# EAGLE schematic EvaluationBoard (EAGLE 9.3.1)

## Sheet 1 of 5
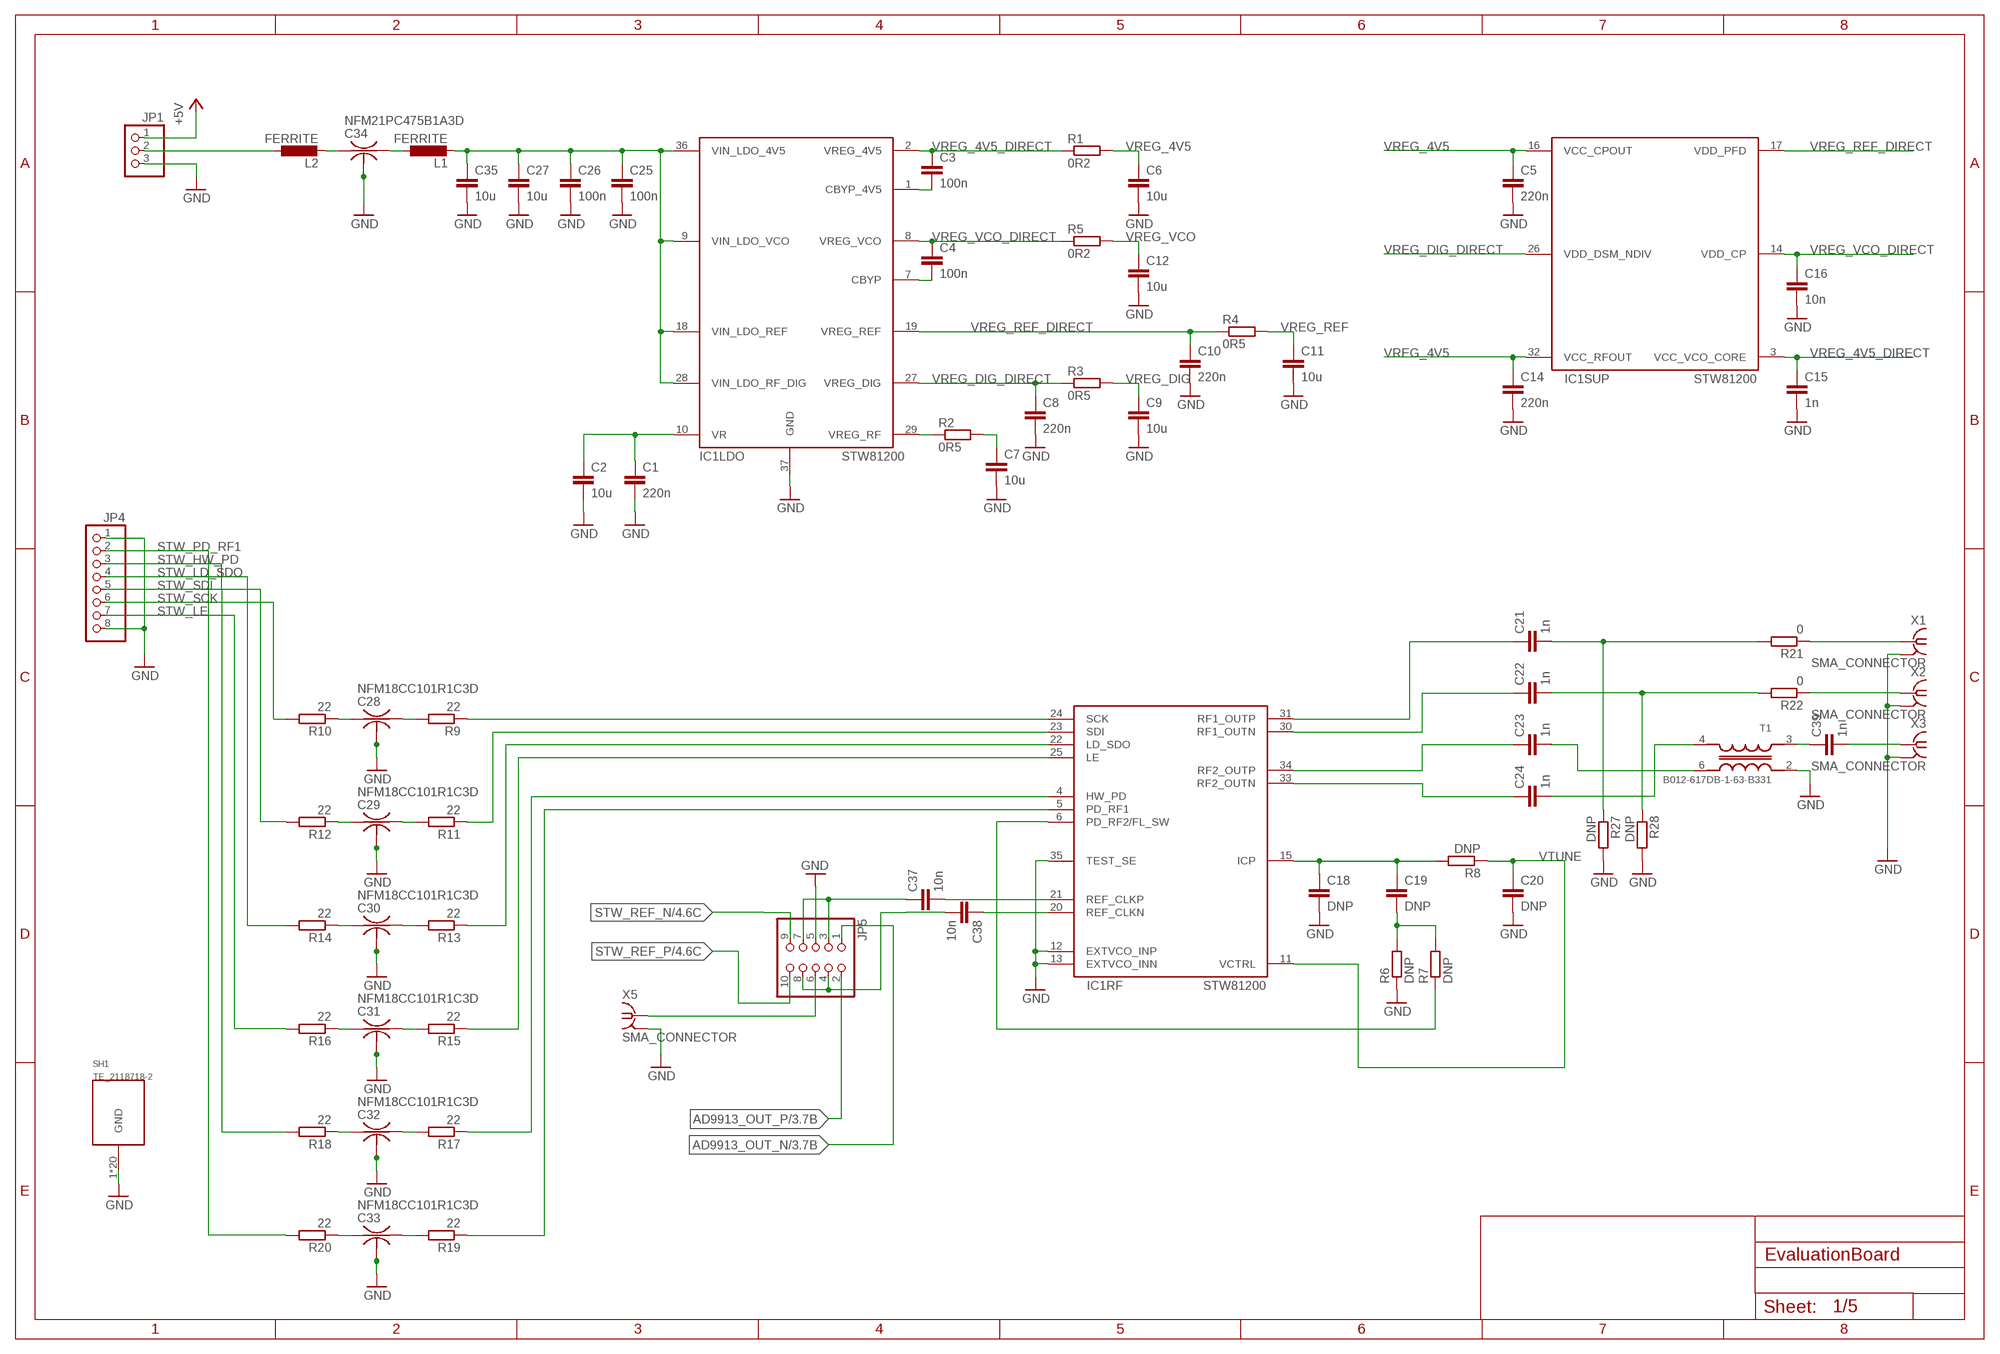
[diagram p0: schematic, sheet 1]

### Parts
C1  220n  C-EUC0402  [C0402]
C2  10u  C-EUC0603  [C0603]
C3  100n  C-EUC0402  [C0402]
C4  100n  C-EUC0402  [C0402]
C5  220n  C-EUC0402  [C0402]
C6  10u  C-EUC0603  [C0603]
C7  10u  C-EUC0603  [C0603]
C8  220n  C-EUC0402  [C0402]
C9  10u  C-EUC0603  [C0603]
C10  220n  C-EUC0402  [C0402]
C11  10u  C-EUC0603  [C0603]
C12  10u  C-EUC0603  [C0603]
C14  220n  C-EUC0402  [C0402]
C15  1n  C-EUC0402  [C0402]
C16  10n  C-EUC0402  [C0402]
C18  DNP  C-EUC0402  [C0402]
C19  DNP  C-EUC0402  [C0402]
C20  DNP  C-EUC0402  [C0402]
C21  1n  C-EUC0402  [C0402]
C22  1n  C-EUC0402  [C0402]
C23  1n  C-EUC0402  [C0402]
C24  1n  C-EUC0402  [C0402]
C25  100n  C-EUC0402  [C0402]
C26  100n  C-EUC0402  [C0402]
C27  10u  C-EUC0603  [C0603]
C28  NFM18CC101R1C3D  [NFM18PC]
C29  NFM18CC101R1C3D  [NFM18PC]
C30  NFM18CC101R1C3D  [NFM18PC]
C31  NFM18CC101R1C3D  [NFM18PC]
C32  NFM18CC101R1C3D  [NFM18PC]
C33  NFM18CC101R1C3D  [NFM18PC]
C34  NFM21PC475B1A3D  [NFM21PC]
C35  10u  C-EUC0603  [C0603]
C37  10n  C-EUC0402  [C0402]
C38  10n  C-EUC0402  [C0402]
C39  1n  C-EUC0402  [C0402]
IC1  STW81200  [QFN50P600X600X100-37T410N]
JP1  PINHD-1X3  [1X03]
JP4  PINHD-1X8  [1X08]
JP5  PINHD-2X5  [2X05]
L1  FERRITE  [R0402]
L2  FERRITE  [R0402]
R1  0R2  R-EU_R0402  [R0402]
R2  0R5  R-EU_R0402  [R0402]
R3  0R5  R-EU_R0402  [R0402]
R4  0R5  R-EU_R0402  [R0402]
R5  0R2  R-EU_R0402  [R0402]
R6  DNP  R-EU_R0402  [R0402]
R7  DNP  R-EU_R0402  [R0402]
R8  DNP  R-EU_R0402  [R0402]
R9  22  R-EU_R0402  [R0402]
R10  22  R-EU_R0402  [R0402]
R11  22  R-EU_R0402  [R0402]
R12  22  R-EU_R0402  [R0402]
R13  22  R-EU_R0402  [R0402]
R14  22  R-EU_R0402  [R0402]
R15  22  R-EU_R0402  [R0402]
R16  22  R-EU_R0402  [R0402]
R17  22  R-EU_R0402  [R0402]
R18  22  R-EU_R0402  [R0402]
R19  22  R-EU_R0402  [R0402]
R20  22  R-EU_R0402  [R0402]
R21  0  R-EU_R0402  [R0402]
R22  0  R-EU_R0402  [R0402]
R27  DNP  R-EU_R0402  [R0402]
R28  DNP  R-EU_R0402  [R0402]
SH1  TE_2118718-2  [TE_2118718-2]
T1  B012-617DB-1-63-B331  [EASTEVER_BALUN]
X1  SMA_CONNECTOR  [J502-ND-142-0711-821/826]
X2  SMA_CONNECTOR  [J502-ND-142-0711-821/826]
X3  SMA_CONNECTOR  [J502-ND-142-0711-821/826]
X5  SMA_CONNECTOR  [J502-ND-142-0711-821/826]

### Nets
+5V: JP1.1 ; also sheet 5
AD9913_OUT_N [100 Ohm differential]: JP5.1 ; also sheet 3
AD9913_OUT_P [100 Ohm differential]: JP5.2 ; also sheet 3
GND: C1.2 C2.2 C5.2 C6.2 C7.2 C8.2 C9.2 C10.2 C11.2 C12.2 C14.2 C15.2 C16.2 C18.2 C20.2 C25.2 C26.2 C27.2 C28.2 C28.4 C29.2 C29.4 C30.2 C30.4 C31.2 C31.4 C32.2 C32.4 C33.2 C33.4 C34.2 C34.4 C35.2 IC1.12(RF:EXTVCO_INP) IC1.13(RF:EXTVCO_INN) IC1.35(RF:TEST_SE) IC1.37(LDO:GND) JP1.3 JP4.1 JP4.8 JP5.5 R6.1 R27.2 R28.2 SH1.1(GND) SH1.2(GND) SH1.3(GND) SH1.4(GND) SH1.5(GND) SH1.6(GND) SH1.7(GND) SH1.8(GND) SH1.9(GND) SH1.10(GND) SH1.11(GND) SH1.12(GND) SH1.13(GND) SH1.14(GND) SH1.15(GND) SH1.16(GND) SH1.17(GND) SH1.18(GND) SH1.19(GND) SH1.20(GND) T1.2(IN-) X1.G@1 X1.G@2 X1.G@3 X1.G@4 X2.G@1 X2.G@2 X2.G@3 X2.G@4 X3.G@1 X3.G@2 X3.G@3 X3.G@4 X5.G@1 X5.G@2 X5.G@3 X5.G@4 ; also sheet 2,3,4,5
N$1: C1.1 C2.1 IC1.10(LDO:VR)
N$2: IC1.6(RF:PD_RF2/FL_SW) R7.1
N$3: C4.2 IC1.7(LDO:CBYP)
N$4: C3.2 IC1.1(LDO:CBYP_4V5)
N$5: C19.2 R6.2 R7.2
N$6: C18.1 C19.1 IC1.15(RF:ICP) R8.2
N$7: C25.1 C26.1 C27.1 C35.1 IC1.9(LDO:VIN_LDO_VCO) IC1.18(LDO:VIN_LDO_REF) IC1.28(LDO:VIN_LDO_RF_DIG) IC1.36(LDO:VIN_LDO_4V5) L1.2
N$8: IC1.29(LDO:VREG_RF) R2.1
N$9: C7.1 R2.2
N$10: C23.1 IC1.34(RF:RF2_OUTP)
N$11: C24.1 IC1.33(RF:RF2_OUTN)
N$12: C22.1 IC1.30(RF:RF1_OUTN)
N$13: C21.1 IC1.31(RF:RF1_OUTP)
N$14: C28.1 R10.1
N$15: C28.3 R9.2
N$16: C29.1 R12.1
N$17: C29.3 R11.2
N$18: C30.1 R14.1
N$19: C30.3 R13.2
N$20: C31.1 R16.1
N$21: C31.3 R15.2
N$22: C32.1 R18.1
N$23: C32.3 R17.2
N$24: C33.1 R20.1
N$25: C33.3 R19.2
N$26: IC1.24(RF:SCK) R9.1
N$27: IC1.23(RF:SDI) R11.1
N$28: IC1.22(RF:LD_SDO) R13.1
N$29: IC1.25(RF:LE) R15.1
N$30: IC1.4(RF:HW_PD) R17.1
N$31: IC1.5(RF:PD_RF1) R19.1
N$32: C34.3 L1.1
N$33: C34.1 L2.2
N$34: R22.1 X2.1
N$35: C22.2 R22.2 R28.1
N$36: C23.2 T1.6(OUT-)
N$37: C39.1 T1.3(IN+)
N$38: C21.2 R21.2 R27.1
N$39: R21.1 X1.1
N$40: C39.2 X3.1
N$42: JP5.6 X5.1
N$47: JP1.2 L2.1
N$54: C24.2 T1.4(OUT+)
STW81200_C_N [100 Ohm differential]: C38.2 JP5.4 JP5.8
STW81200_C_P [100 Ohm differential]: C37.1 JP5.3 JP5.7
STW81200_CLK_N [100 Ohm differential]: C38.1 IC1.20(RF:REF_CLKN)
STW81200_CLK_P [100 Ohm differential]: C37.2 IC1.21(RF:REF_CLKP)
STW_HW_PD: JP4.3 R18.2 ; also sheet 5
STW_LD_SDO: JP4.4 R14.2 ; also sheet 5
STW_LE: JP4.7 R16.2 ; also sheet 5
STW_PD_RF1: JP4.2 R20.2 ; also sheet 5
STW_REF_N [100 Ohm differential]: JP5.9 ; also sheet 4
STW_REF_P [100 Ohm differential]: JP5.10 ; also sheet 4
STW_SCK: JP4.6 R10.2 ; also sheet 5
STW_SDI: JP4.5 R12.2 ; also sheet 5
VREG_4V5: C5.1 C6.1 C14.1 IC1.16(SUP:VCC_CPOUT) IC1.32(SUP:VCC_RFOUT) R1.2
VREG_4V5_DIRECT: C3.1 C15.1 IC1.2(LDO:VREG_4V5) IC1.3(SUP:VCC_VCO_CORE) R1.1
VREG_DIG: C9.1 R3.2
VREG_DIG_DIRECT: C8.1 IC1.26(SUP:VDD_DSM_NDIV) IC1.27(LDO:VREG_DIG) R3.1
VREG_REF: C11.1 R4.2
VREG_REF_DIRECT: C10.1 IC1.17(SUP:VDD_PFD) IC1.19(LDO:VREG_REF) R4.1
VREG_VCO: C12.1 R5.2
VREG_VCO_DIRECT: C4.1 C16.1 IC1.8(LDO:VREG_VCO) IC1.14(SUP:VDD_CP) R5.1
VTUNE: C20.1 IC1.11(RF:VCTRL) R8.1

## Sheet 2 of 5
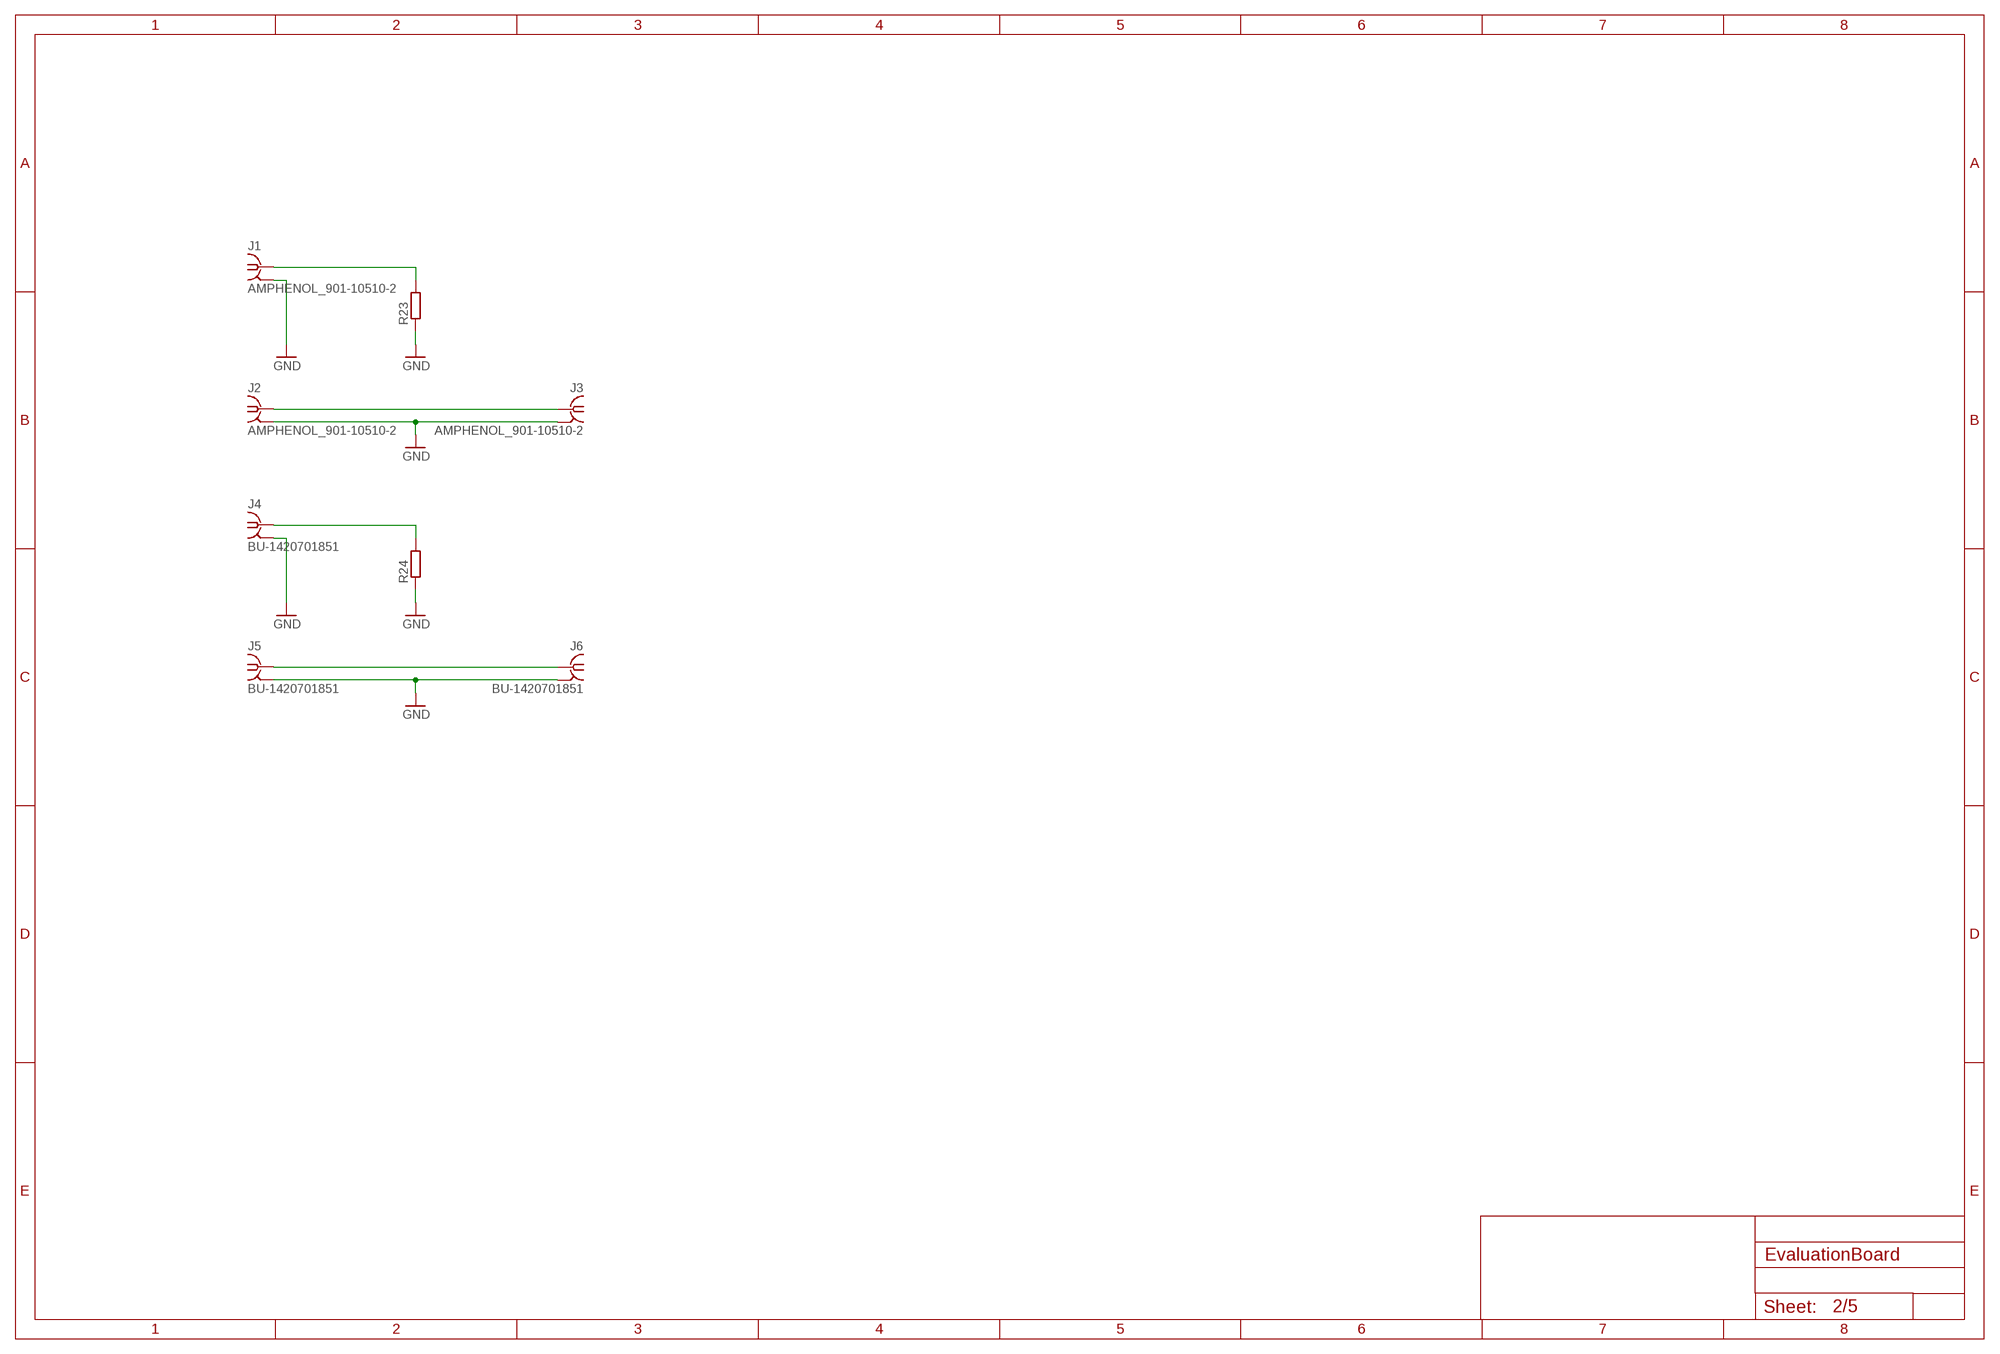
[diagram p1: schematic, sheet 2]

### Parts
J1  AMPHENOL_901-10510-2  [AMPHENOL_901-10510-2]
J2  AMPHENOL_901-10510-2  [AMPHENOL_901-10510-2]
J3  AMPHENOL_901-10510-2  [AMPHENOL_901-10510-2]
J4  BU-1420701851  [BU-1420701851]
J5  BU-1420701851  [BU-1420701851]
J6  BU-1420701851  [BU-1420701851]
R23  R-EU_R0402  [R0402]
R24  R-EU_R0402  [R0402]

### Nets
GND: J1.G1 J1.G2 J1.G3 J1.G4 J2.G1 J2.G2 J2.G3 J2.G4 J3.G1 J3.G2 J3.G3 J3.G4 J4.G@1 J4.G@2 J4.G@3 J4.G@4 J5.G@1 J5.G@2 J5.G@3 J5.G@4 J6.G@1 J6.G@2 J6.G@3 J6.G@4 R23.1 R24.1 ; also sheet 1,3,4,5
N$41: J1.S R23.2
N$55: J2.S J3.S
N$56: J4.1 R24.2
N$57: J5.1 J6.1

## Sheet 3 of 5
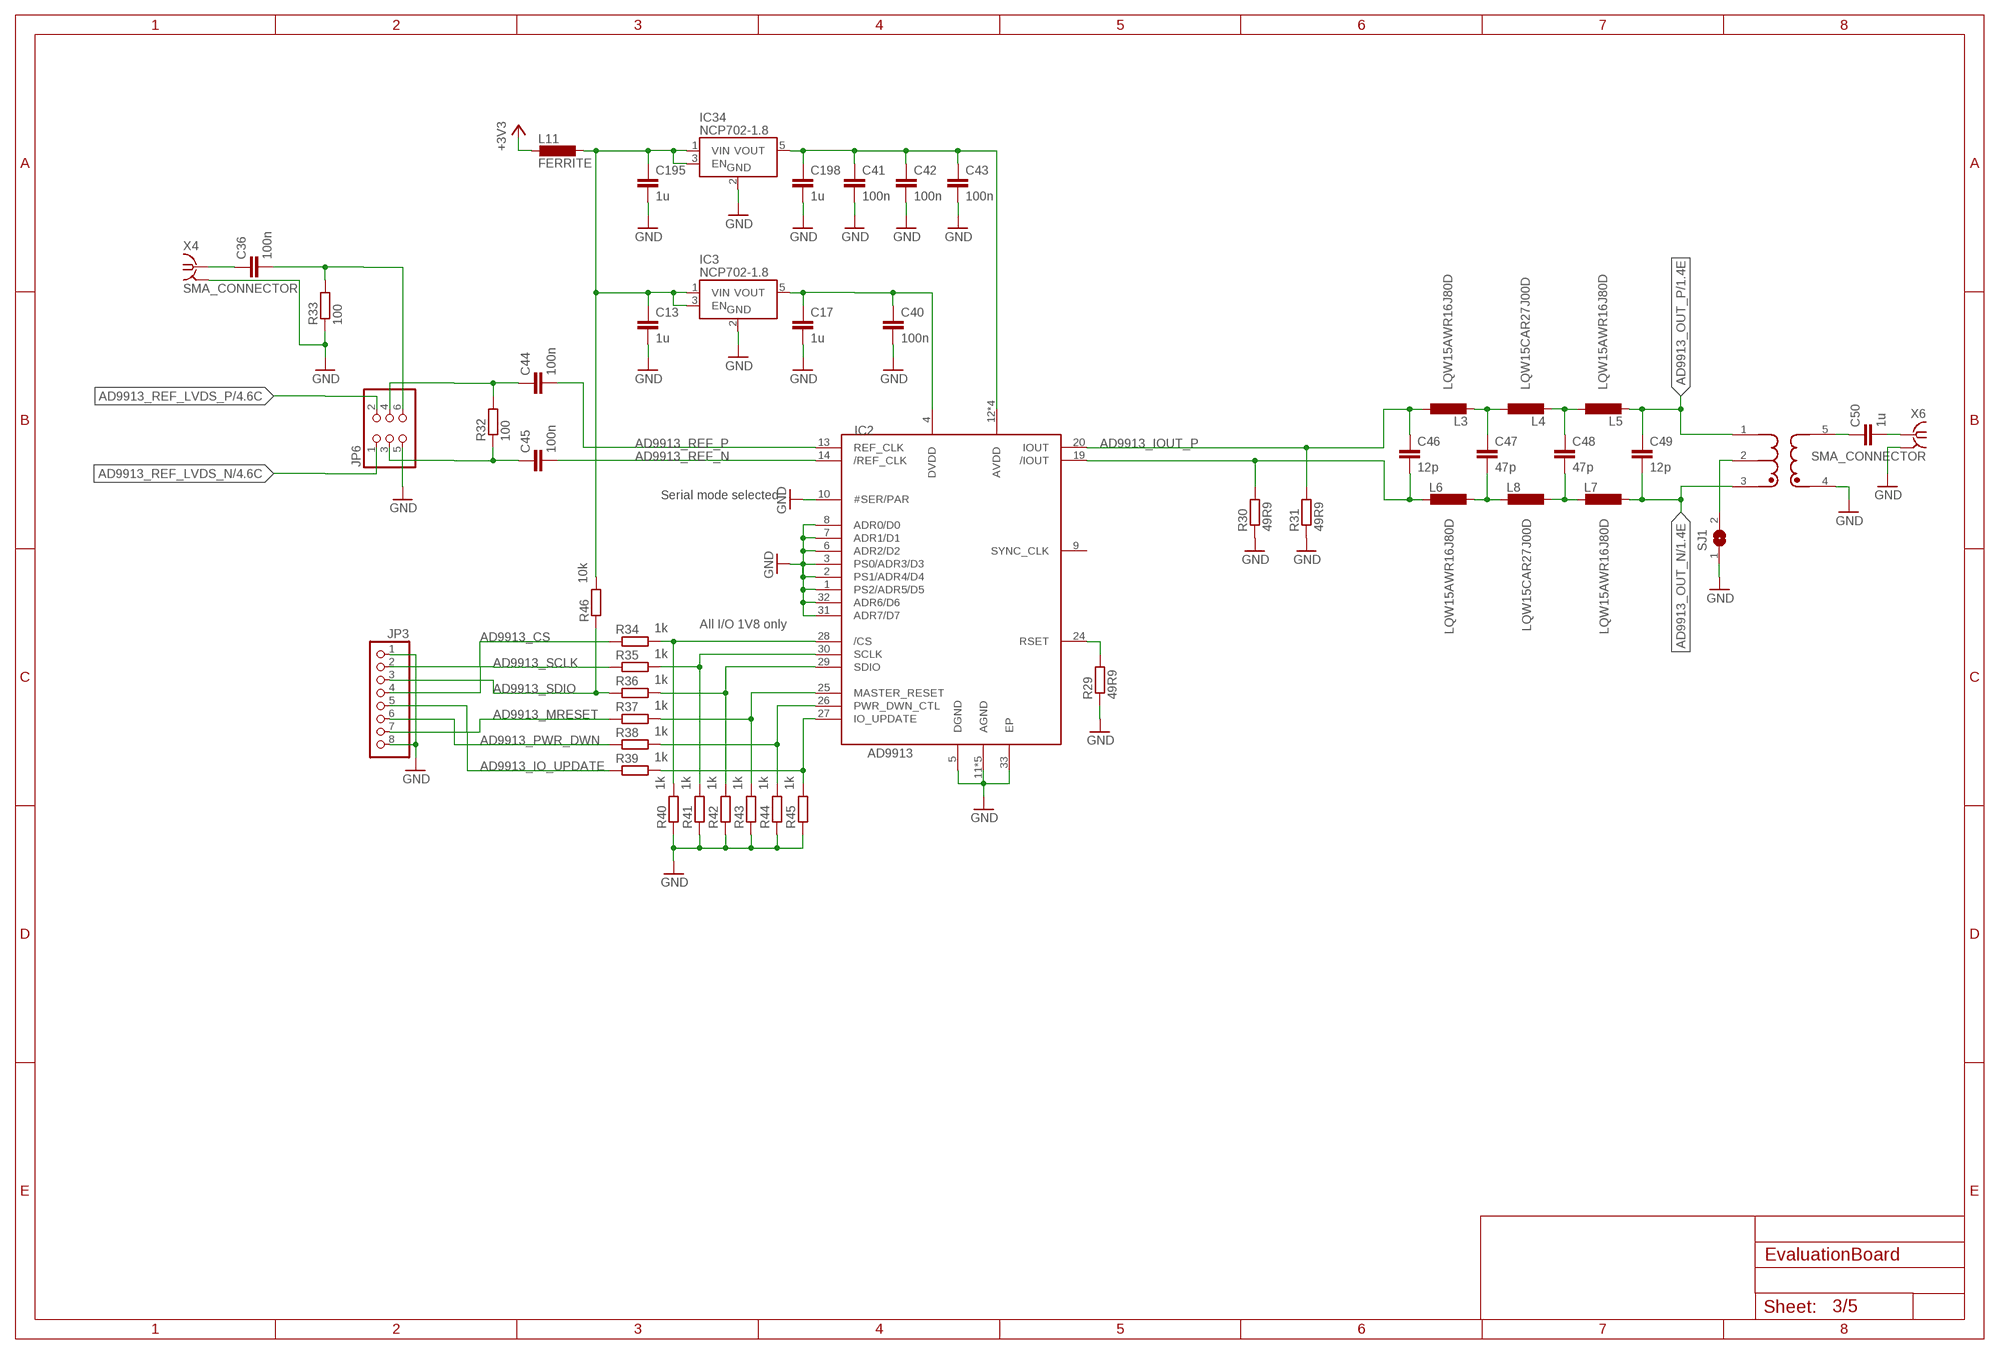
[diagram p2: schematic, sheet 3]

### Parts
B1  ETC1-1T-2  ETC1-1T  [SM-22]
C13  1u  C-EUC0402:2  [C0402]
C17  1u  C-EUC0402:2  [C0402]
C36  100n  C-EUC0402:2  [C0402]
C40  100n  C-EUC0402:2  [C0402]
C41  100n  C-EUC0402:2  [C0402]
C42  100n  C-EUC0402:2  [C0402]
C43  100n  C-EUC0402:2  [C0402]
C44  100n  C-EUC0402:2  [C0402]
C45  100n  C-EUC0402:2  [C0402]
C46  12p  C-EUC0402:2  [C0402]
C47  47p  C-EUC0402:2  [C0402]
C48  47p  C-EUC0402:2  [C0402]
C49  12p  C-EUC0402:2  [C0402]
C50  1u  C-EUC0402:2  [C0402]
C195  1u  C-EUC0402:2  [C0402]
C198  1u  C-EUC0402:2  [C0402]
IC2  AD9913  [QFN50P500X500X80-33T310]
IC3  NCP702-1.8  NCP702  [SOT95P240X110-5]
IC34  NCP702-1.8  NCP702  [SOT95P240X110-5]
JP3  PINHD-1X8  [1X08]
JP6  PINHD-2X3  [2X03]
L3  LQW15AWR16J80D  INDUCTOR0402  [L0402]
L4  LQW15CAR27J00D  INDUCTOR0402  [L0402]
L5  LQW15AWR16J80D  INDUCTOR0402  [L0402]
L6  LQW15AWR16J80D  INDUCTOR0402  [L0402]
L7  LQW15AWR16J80D  INDUCTOR0402  [L0402]
L8  LQW15CAR27J00D  INDUCTOR0402  [L0402]
L11  FERRITE  [R0402]
R29  49R9  R-EU_R0402  [R0402]
R30  49R9  R-EU_R0402  [R0402]
R31  49R9  R-EU_R0402  [R0402]
R32  100  R-EU_R0402  [R0402]
R33  100  R-EU_R0402  [R0402]
R34  1k  R-EU_R0402  [R0402]
R35  1k  R-EU_R0402  [R0402]
R36  1k  R-EU_R0402  [R0402]
R37  1k  R-EU_R0402  [R0402]
R38  1k  R-EU_R0402  [R0402]
R39  1k  R-EU_R0402  [R0402]
R40  1k  R-EU_R0402  [R0402]
R41  1k  R-EU_R0402  [R0402]
R42  1k  R-EU_R0402  [R0402]
R43  1k  R-EU_R0402  [R0402]
R44  1k  R-EU_R0402  [R0402]
R45  1k  R-EU_R0402  [R0402]
R46  10k  R-EU_R0402  [R0402]
SJ1  SJ  [SJ]
X4  SMA_CONNECTOR  [J502-ND-142-0711-821/826]
X6  SMA_CONNECTOR  [J502-ND-142-0711-821/826]

### Nets
+3V3: L11.2 ; also sheet 4,5
AD9913_CS: JP3.4 R34.1 ; also sheet 5
AD9913_IO_UPDATE: JP3.5 R39.1 ; also sheet 5
AD9913_IOUT_N [100 Ohm differential]: C46.2 IC2.19(/IOUT) L6.2 R30.2
AD9913_IOUT_P [100 Ohm differential]: C46.1 IC2.20(IOUT) L3.1 R31.2
AD9913_MRESET: JP3.7 R37.1 ; also sheet 5
AD9913_OUT_N [100 Ohm differential]: B1.3(SEC_DOT) C49.2 L7.1 ; also sheet 1
AD9913_OUT_P [100 Ohm differential]: B1.1(SEC) C49.1 L5.2 ; also sheet 1
AD9913_PWR_DWN: JP3.6 R38.1 ; also sheet 5
AD9913_REF_IN_N [100 Ohm differential]: C45.1 JP6.3 R32.1
AD9913_REF_IN_P [100 Ohm differential]: C44.1 JP6.4 R32.2
AD9913_REF_LVDS_N [100 Ohm differential]: JP6.1 ; also sheet 4
AD9913_REF_LVDS_P [100 Ohm differential]: JP6.2 ; also sheet 4
AD9913_REF_N [100 Ohm differential]: C45.2 IC2.14(/REF_CLK)
AD9913_REF_P [100 Ohm differential]: C44.2 IC2.13(REF_CLK)
AD9913_SCLK: JP3.2 R35.1 ; also sheet 5
AD9913_SDIO: JP3.3 R36.1 R46.1 ; also sheet 5
GND: B1.4(PRI_DOT) C13.2 C17.2 C40.2 C41.2 C42.2 C43.2 C195.2 C198.2 IC2.1(PS2/ADR5/D5) IC2.2(PS1/ADR4/D4) IC2.3(PS0/ADR3/D3) IC2.5(DGND) IC2.6(ADR2/D2) IC2.7(ADR1/D1) IC2.8(ADR0/D0) IC2.10(#SER/PAR) IC2.11(AGND) IC2.15(AGND) IC2.18(AGND) IC2.21(AGND) IC2.23(AGND) IC2.31(ADR7/D7) IC2.32(ADR6/D6) IC2.33(EP) IC3.2(GND) IC34.2(GND) JP3.1 JP3.8 JP6.5 R29.1 R30.1 R31.1 R33.1 R40.1 R41.1 R42.1 R43.1 R44.1 R45.1 SJ1.1 X4.G@1 X4.G@2 X4.G@3 X4.G@4 X6.G@1 X6.G@2 X6.G@3 X6.G@4 ; also sheet 1,2,4,5
N$51: C13.1 C195.1 IC3.1(VIN) IC3.3(EN) IC34.1(VIN) IC34.3(EN) L11.1 R46.2
N$58: C17.1 C40.1 IC2.4(DVDD) IC3.5(VOUT)
N$59: IC2.24(RSET) R29.2
N$66: C36.2 JP6.6 R33.2
N$67: IC2.28(/CS) R34.2 R40.2
N$68: IC2.30(SCLK) R35.2 R41.2
N$69: IC2.29(SDIO) R36.2 R42.2
N$70: IC2.25(MASTER_RESET) R37.2 R43.2
N$71: IC2.26(PWR_DWN_CTL) R38.2 R44.2
N$72: IC2.27(IO_UPDATE) R39.2 R45.2
N$73: C47.1 L3.2 L4.1
N$74: C47.2 L6.1 L8.2
N$75: C48.2 L7.2 L8.1
N$76: C48.1 L4.2 L5.1
N$77: B1.2(SEC_CT) SJ1.2
N$78: C50.2 X6.1
N$79: C36.1 X4.1
N$80: B1.5(PRI) C50.1
N$205: C41.1 C42.1 C43.1 C198.1 IC2.12(AVDD) IC2.16(AVDD) IC2.17(AVDD) IC2.22(AVDD) IC34.5(VOUT)
Unconnected: IC2.9(SYNC_CLK)

### Notes on the sheet
- Serial mode selected
- All I/O 1V8 only

## Sheet 4 of 5
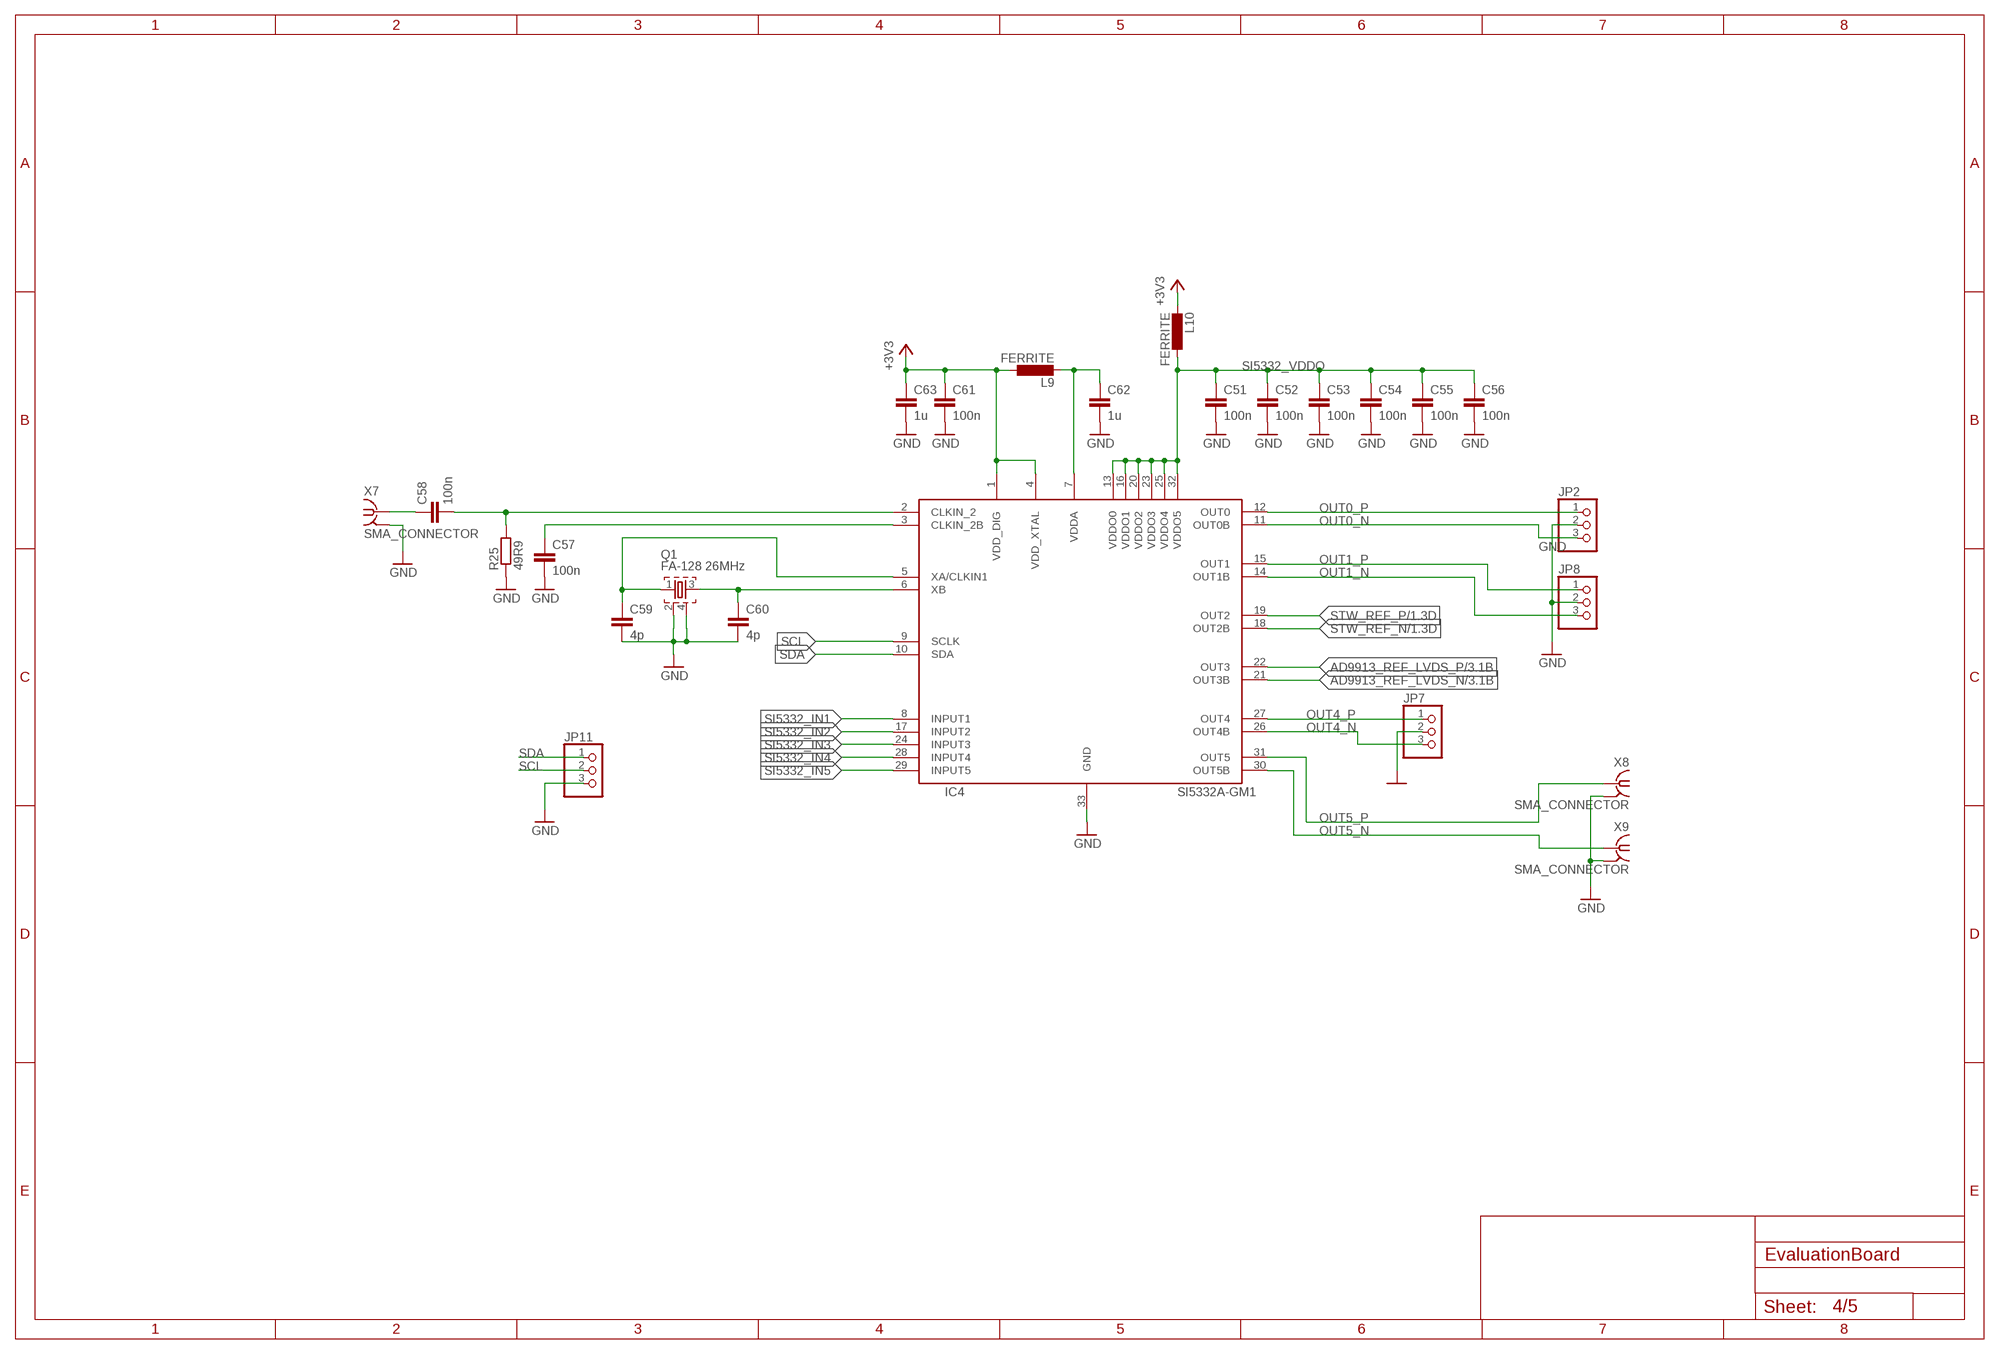
[diagram p3: schematic, sheet 4]

### Parts
C51  100n  C-EUC0402:2  [C0402]
C52  100n  C-EUC0402:2  [C0402]
C53  100n  C-EUC0402:2  [C0402]
C54  100n  C-EUC0402:2  [C0402]
C55  100n  C-EUC0402:2  [C0402]
C56  100n  C-EUC0402:2  [C0402]
C57  100n  C-EUC0402:2  [C0402]
C58  100n  C-EUC0402:2  [C0402]
C59  4p  C-EUC0402:2  [C0402]
C60  4p  C-EUC0402:2  [C0402]
C61  100n  C-EUC0402:2  [C0402]
C62  1u  C-EUC0402:2  [C0402]
C63  1u  C-EUC0402:2  [C0402]
IC4  SI5332A-GM1  [QFN50P500X500X100-33T345N]
JP2  PINHD-1X3  [1X03]
JP7  PINHD-1X3  [1X03]
JP8  PINHD-1X3  [1X03]
JP11  PINHD-1X3  [1X03]
L9  FERRITE  [R0402]
L10  FERRITE  [R0402]
Q1  FA-128 26MHz  FA-128  [FA-128]
R25  49R9  R-EU_R0402  [R0402]
X7  SMA_CONNECTOR  [J502-ND-142-0711-821/826]
X8  SMA_CONNECTOR  [J502-ND-142-0711-821/826]
X9  SMA_CONNECTOR  [J502-ND-142-0711-821/826]

### Nets
+3V3: C61.1 C63.1 IC4.1(VDD_DIG) IC4.4(VDD_XTAL) L9.1 L10.2 ; also sheet 3,5
AD9913_REF_LVDS_N [100 Ohm differential]: IC4.21(OUT3B) ; also sheet 3
AD9913_REF_LVDS_P [100 Ohm differential]: IC4.22(OUT3) ; also sheet 3
GND: C51.2 C52.2 C53.2 C54.2 C55.2 C56.2 C57.2 C59.2 C60.2 C61.2 C62.2 C63.2 IC4.33(GND) JP2.2 JP7.2 JP8.2 JP11.3 Q1.2 Q1.4 R25.1 X7.G@1 X7.G@2 X7.G@3 X7.G@4 X8.G@1 X8.G@2 X8.G@3 X8.G@4 X9.G@1 X9.G@2 X9.G@3 X9.G@4 ; also sheet 1,2,3,5
N$43: C57.1 IC4.3(CLKIN_2B)
N$44: C58.2 IC4.2(CLKIN_2) R25.2
N$45: C58.1 X7.1
N$46: C60.1 IC4.6(XB) Q1.3
N$60: C59.1 IC4.5(XA/CLKIN1) Q1.1
N$62: C62.1 IC4.7(VDDA) L9.2
OUT0_N [100 Ohm differential]: IC4.11(OUT0B) JP2.3
OUT0_P [100 Ohm differential]: IC4.12(OUT0) JP2.1
OUT1_N [100 Ohm differential]: IC4.14(OUT1B) JP8.3
OUT1_P [100 Ohm differential]: IC4.15(OUT1) JP8.1
OUT4_N [100 Ohm differential]: IC4.26(OUT4B) JP7.3
OUT4_P [100 Ohm differential]: IC4.27(OUT4) JP7.1
OUT5_N [100 Ohm differential]: IC4.30(OUT5B) X9.1
OUT5_P [100 Ohm differential]: IC4.31(OUT5) X8.1
SCL: IC4.9(SCLK) JP11.2 ; also sheet 5
SDA: IC4.10(SDA) JP11.1 ; also sheet 5
SI5332_IN1: IC4.8(INPUT1) ; also sheet 5
SI5332_IN2: IC4.17(INPUT2) ; also sheet 5
SI5332_IN3: IC4.24(INPUT3) ; also sheet 5
SI5332_IN4: IC4.28(INPUT4) ; also sheet 5
SI5332_IN5: IC4.29(INPUT5) ; also sheet 5
SI5332_VDDO: C51.1 C52.1 C53.1 C54.1 C55.1 C56.1 IC4.13(VDDO0) IC4.16(VDDO1) IC4.20(VDDO2) IC4.23(VDDO3) IC4.25(VDDO4) IC4.32(VDDO5) L10.1
STW_REF_N [100 Ohm differential]: IC4.18(OUT2B) ; also sheet 1
STW_REF_P [100 Ohm differential]: IC4.19(OUT2) ; also sheet 1

## Sheet 5 of 5
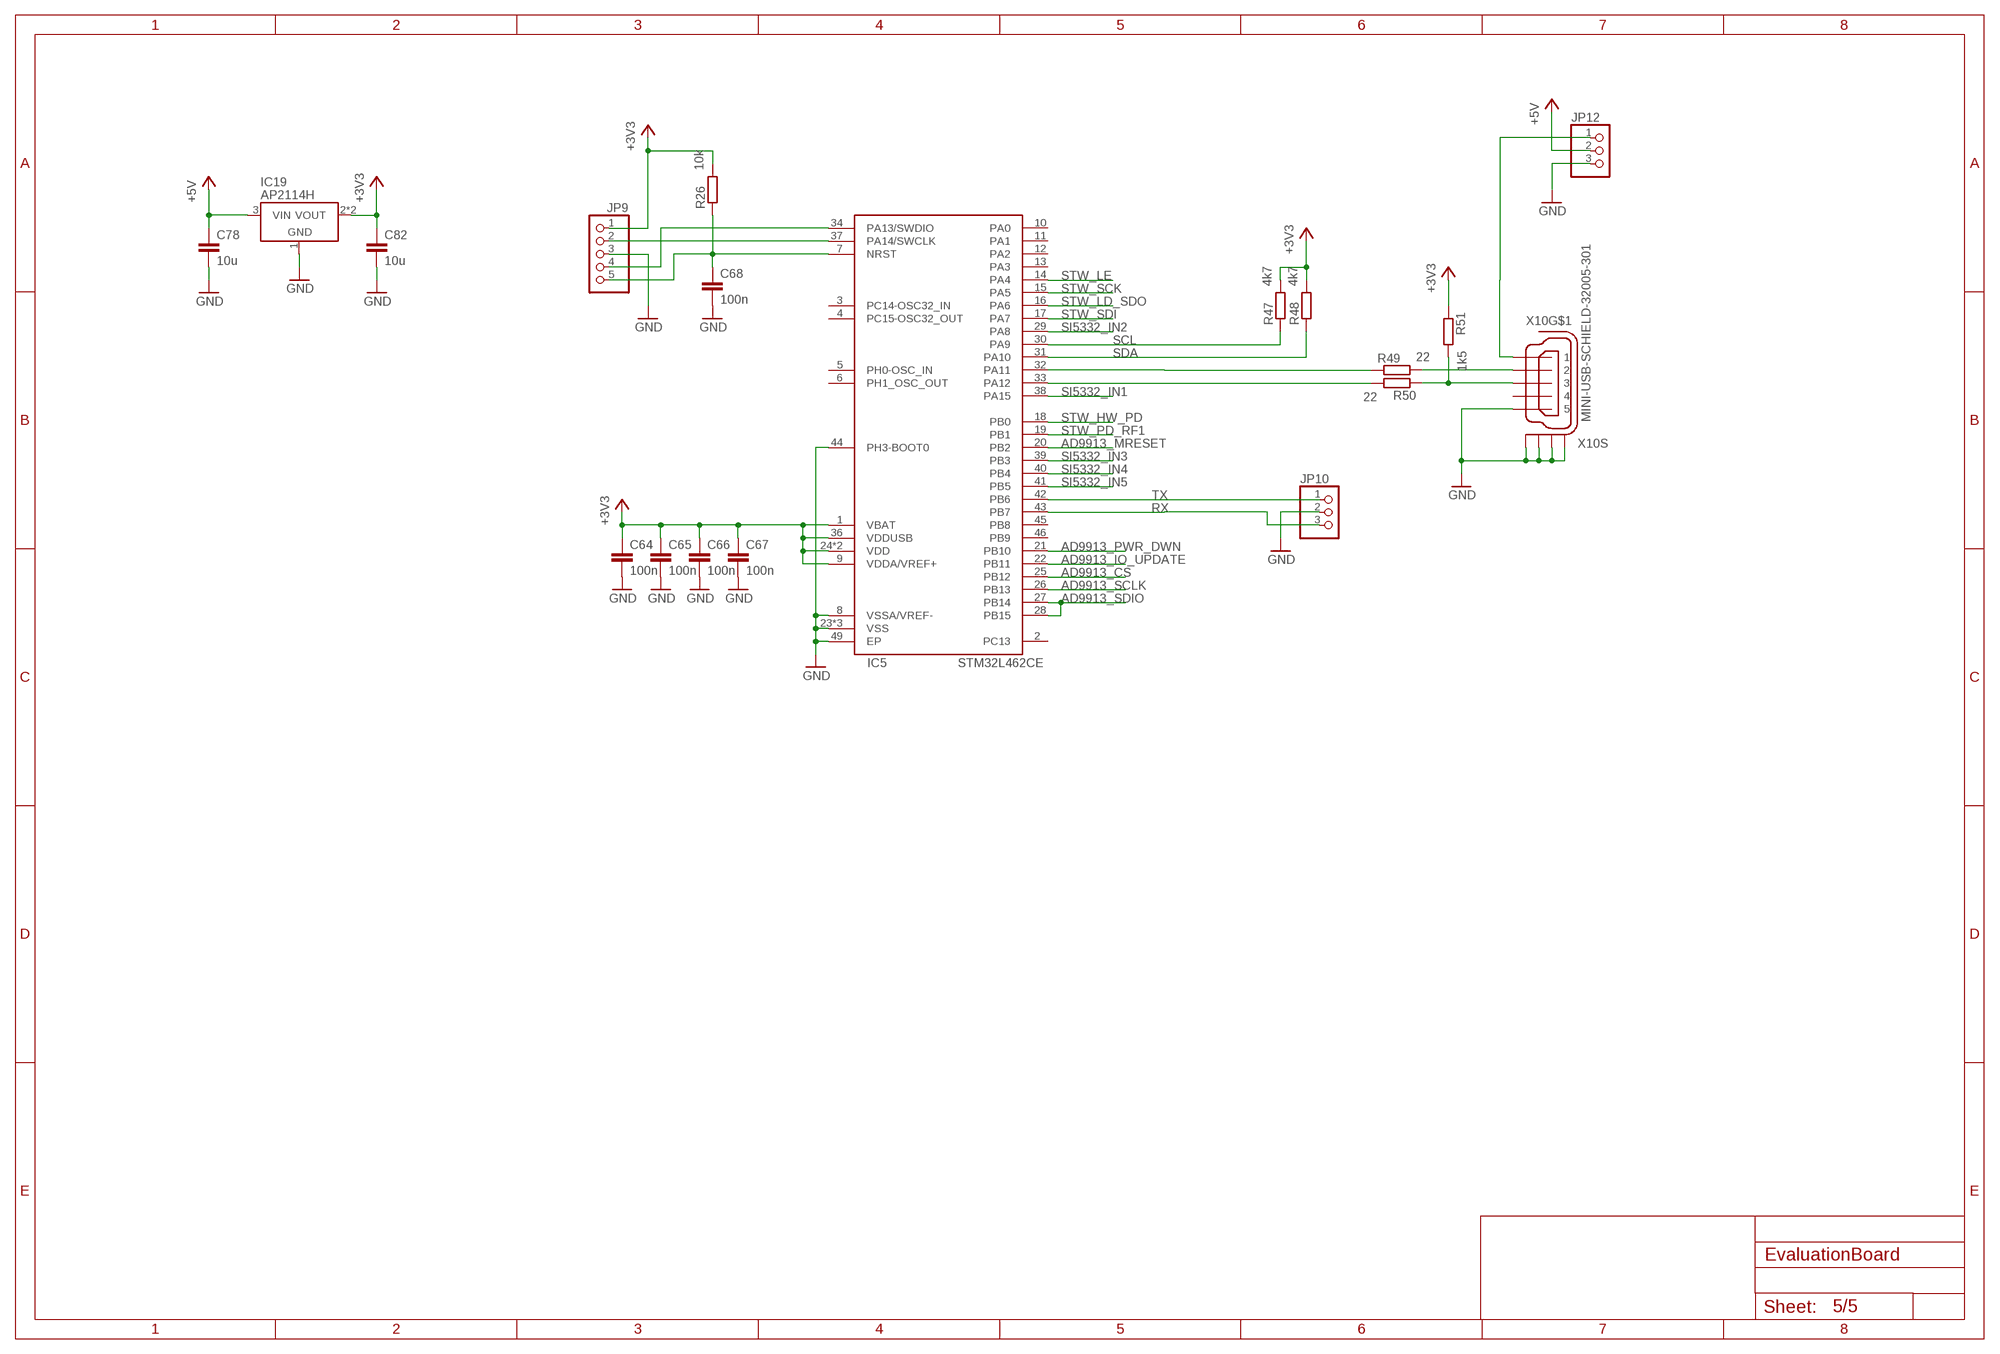
[diagram p4: schematic, sheet 5]

### Parts
C64  100n  C-EUC0402:2  [C0402]
C65  100n  C-EUC0402:2  [C0402]
C66  100n  C-EUC0402:2  [C0402]
C67  100n  C-EUC0402:2  [C0402]
C68  100n  C-EUC0402:2  [C0402]
C78  10u  C-EUC1206  [C1206]
C82  10u  C-EUC1206  [C1206]
IC5  STM32L462CE  [QFN50P700X700X60-49T560N]
IC19  AP2114H  [SOT230P700X180-4]
JP9  PINHD-1X5  [1X05]
JP10  PINHD-1X3  [1X03]
JP12  PINHD-1X3  [1X03]
R26  10k  R-EU_R0402  [R0402]
R47  4k7  R-EU_R0402  [R0402]
R48  4k7  R-EU_R0402  [R0402]
R49  22  R-EU_R0402  [R0402]
R50  22  R-EU_R0402  [R0402]
R51  1k5  R-EU_R0402  [R0402]
X10  MINI-USB-SCHIELD-32005-301  [32005-301]

### Nets
+3V3: C64.1 C65.1 C66.1 C67.1 C82.1 IC5.1(VBAT) IC5.9(VDDA/VREF+) IC5.24(VDD) IC5.36(VDDUSB) IC5.48(VDD) IC19.2(VOUT) IC19.4(VOUT) JP9.1 R26.2 R47.2 R48.2 R51.1 ; also sheet 3,4
+5V: C78.1 IC19.3(VIN) JP12.2 ; also sheet 1
AD9913_CS: IC5.25(PB12) ; also sheet 3
AD9913_IO_UPDATE: IC5.22(PB11) ; also sheet 3
AD9913_MRESET: IC5.20(PB2) ; also sheet 3
AD9913_PWR_DWN: IC5.21(PB10) ; also sheet 3
AD9913_SCLK: IC5.26(PB13) ; also sheet 3
AD9913_SDIO: IC5.27(PB14) IC5.28(PB15) ; also sheet 3
GND: C64.2 C65.2 C66.2 C67.2 C68.2 C78.2 C82.2 IC5.8(VSSA/VREF-) IC5.23(VSS) IC5.35(VSS) IC5.44(PH3-BOOT0) IC5.47(VSS) IC5.49(EP) IC19.1(GND) JP9.3 JP10.2 JP12.3 X10.5 X10.M1(S:S1) X10.M2(S:S2) X10.M3(S:S3) X10.M4(S:S4) ; also sheet 1,2,3,4
N$49: JP12.1 X10.1
N$61 [100 Ohm differential]: IC5.37(PA14/SWCLK) JP9.2
N$63 [100 Ohm differential]: IC5.34(PA13/SWDIO) JP9.4
N$64 [100 Ohm differential]: C68.1 IC5.7(NRST) JP9.5 R26.1
N$185: R49.2 X10.2
N$186: R50.1 R51.2 X10.3
N$187: IC5.32(PA11) R49.1
N$188: IC5.33(PA12) R50.2
RX [100 Ohm differential]: IC5.43(PB7) JP10.3
SCL: IC5.30(PA9) R47.1 ; also sheet 4
SDA: IC5.31(PA10) R48.1 ; also sheet 4
SI5332_IN1: IC5.38(PA15) ; also sheet 4
SI5332_IN2: IC5.29(PA8) ; also sheet 4
SI5332_IN3: IC5.39(PB3) ; also sheet 4
SI5332_IN4: IC5.40(PB4) ; also sheet 4
SI5332_IN5: IC5.41(PB5) ; also sheet 4
STW_HW_PD: IC5.18(PB0) ; also sheet 1
STW_LD_SDO: IC5.16(PA6) ; also sheet 1
STW_LE: IC5.14(PA4) ; also sheet 1
STW_PD_RF1: IC5.19(PB1) ; also sheet 1
STW_SCK: IC5.15(PA5) ; also sheet 1
STW_SDI: IC5.17(PA7) ; also sheet 1
TX [100 Ohm differential]: IC5.42(PB6) JP10.1
Unconnected: IC5.2(PC13) IC5.3(PC14-OSC32_IN) IC5.4(PC15-OSC32_OUT) IC5.5(PH0-OSC_IN) IC5.6(PH1_OSC_OUT) IC5.10(PA0) IC5.11(PA1) IC5.12(PA2) IC5.13(PA3) IC5.45(PB8) IC5.46(PB9) X10.4

## Library data of the parts
B1 = transformers:ETC1-1T
C1-C12 C14-C16 C18-C27 C35 C37-C39 = rcl:C-EU: CAPACITOR, European symbol; SPICEPREFIX: C
C13 C17 C36 C40-C68 C195 C198 = VNA:C-EU*?:2: CAPACITOR, European symbol
C28-C33 = VNA:NFM18CC101R1C3D
C34 = VNA:NFM21PC475B1A3D
C78 C82 = VNA:C-EU: CAPACITOR, European symbol
IC1 = VNA:STW81200
IC2 = VNA:AD9913
IC3 IC34 = VNA:NCP702
IC4 = VNA:SI5332A-GM1
IC5 = VNA:STM32L462CE
IC19 = VNA:AP2114
J1-J3 = VNA:AMPHENOL_901-10510-2
J4-J6 = VNA:BU-1420701851
JP1 JP2 JP7 JP8 JP10-JP12 = pinhead:PINHD-1X3: PIN HEADER
JP3 JP4 = pinhead:PINHD-1X8: PIN HEADER
JP5 = pinhead:PINHD-2X5: PIN HEADER
JP6 = pinhead:PINHD-2X3: PIN HEADER
JP9 = pinhead:PINHD-1X5: PIN HEADER
L1 L2 L9-L11 = VNA:FERRITE
L3-L8 = VNA:INDUCTOR
Q1 = crystal:FA-: MHz RANGE CRYSTAL UNIT Source: Epson Toyocom
R1-R51 = VNA:R-EU_: RESISTOR, European symbol
SH1 = VNA:TE_2118718-2
SJ1 = jumper:SJ: SMD solder JUMPER
T1 = VNA:B012-617DB-1-63-B331
X1-X9 = VNA:SMA_CONNECTOR
X10 = VNA:MINI-USB-SCHIELD-: MINI USB-B Conector Source: www.cypressindustries.com; OC_FARNELL: unknown; OC_NEWARK: unknown

## Net classes
1 100 Ohm differential: width 0.2 mm, drill 0.2 mm, clearance 0.2 mm